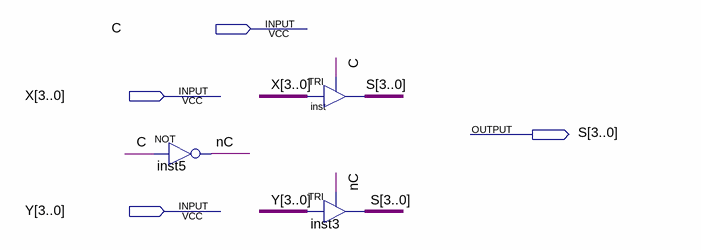
[diagram p0: schematic sheet]
// Quartus schematic sel4.bdf as structural Verilog: 3 symbols, 4 pins
module sel4 (
  input  C,
  input  [3:0] X,
  input  [3:0] Y,
  output [3:0] S
);

  wire nC;

  not inst5 (nC, C);
  TRI inst[3:0] (.IN(X), .OE(C), .OUT(S));
  TRI inst3[3:0] (.IN(Y), .OE(nC), .OUT(S));
endmodule
